# Altium schematic sheet DUT.SchDoc
size A1; SPICEModelCacheEPBFKGZM: <root> / <DocumentId>EPBFKGZM</DocumentId> / </root>
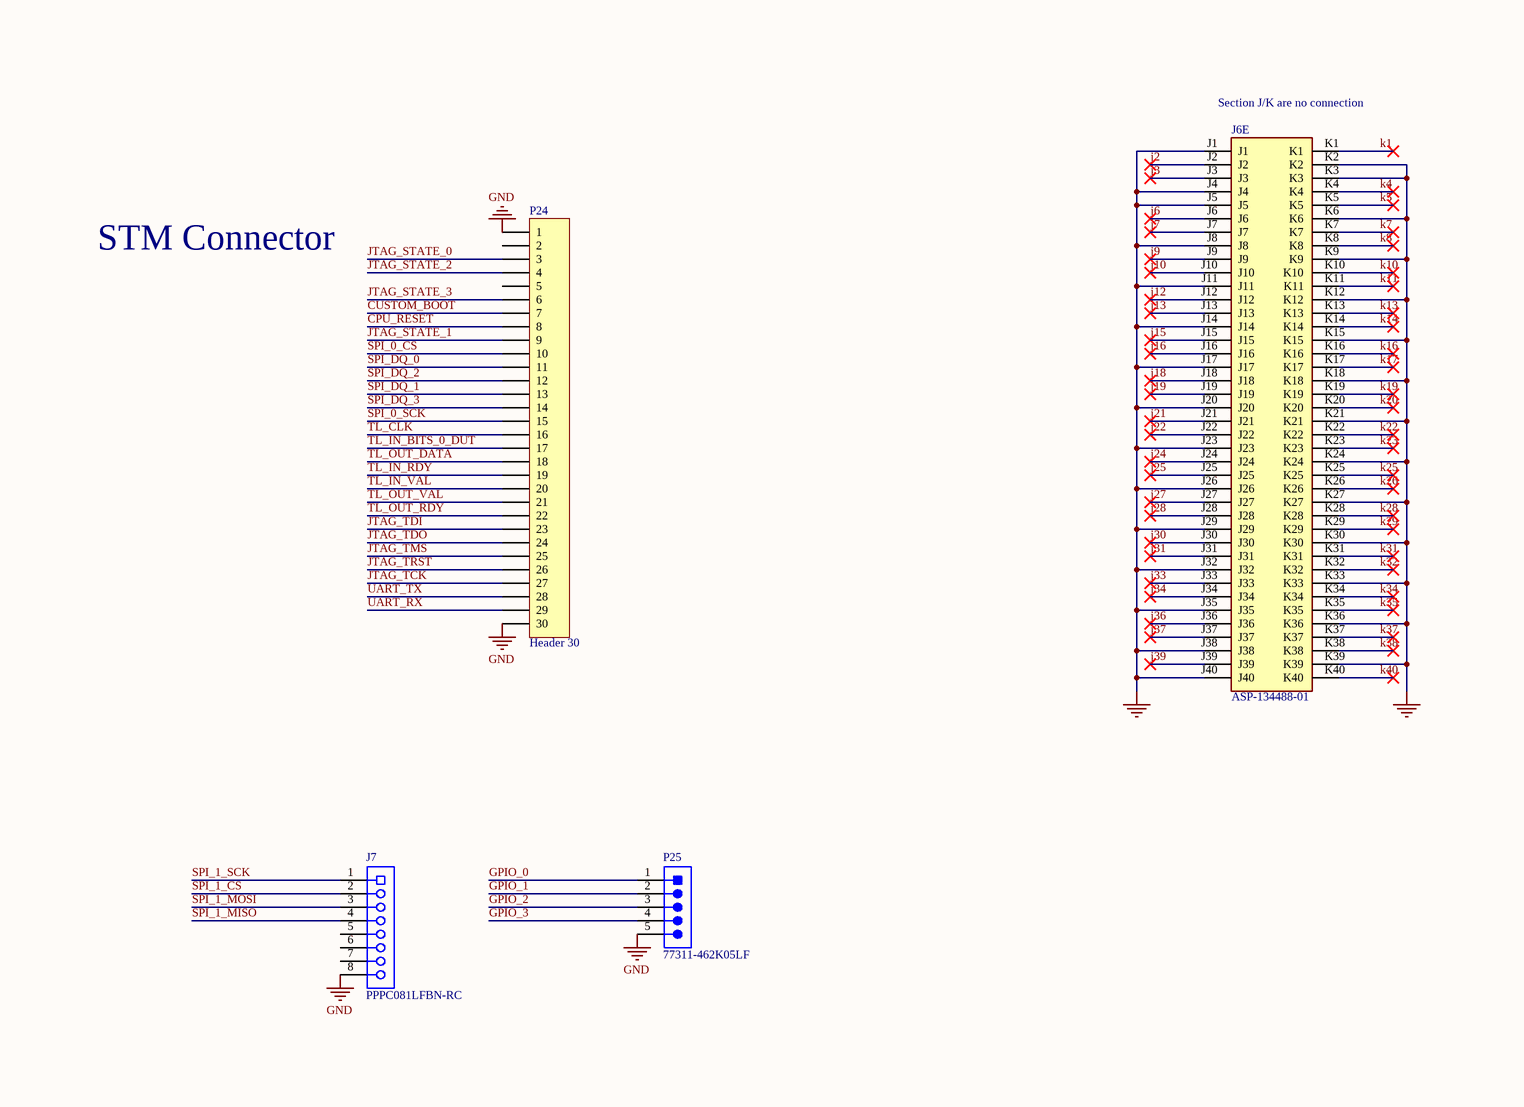
[diagram p0: DUT.SchDoc, centre left]
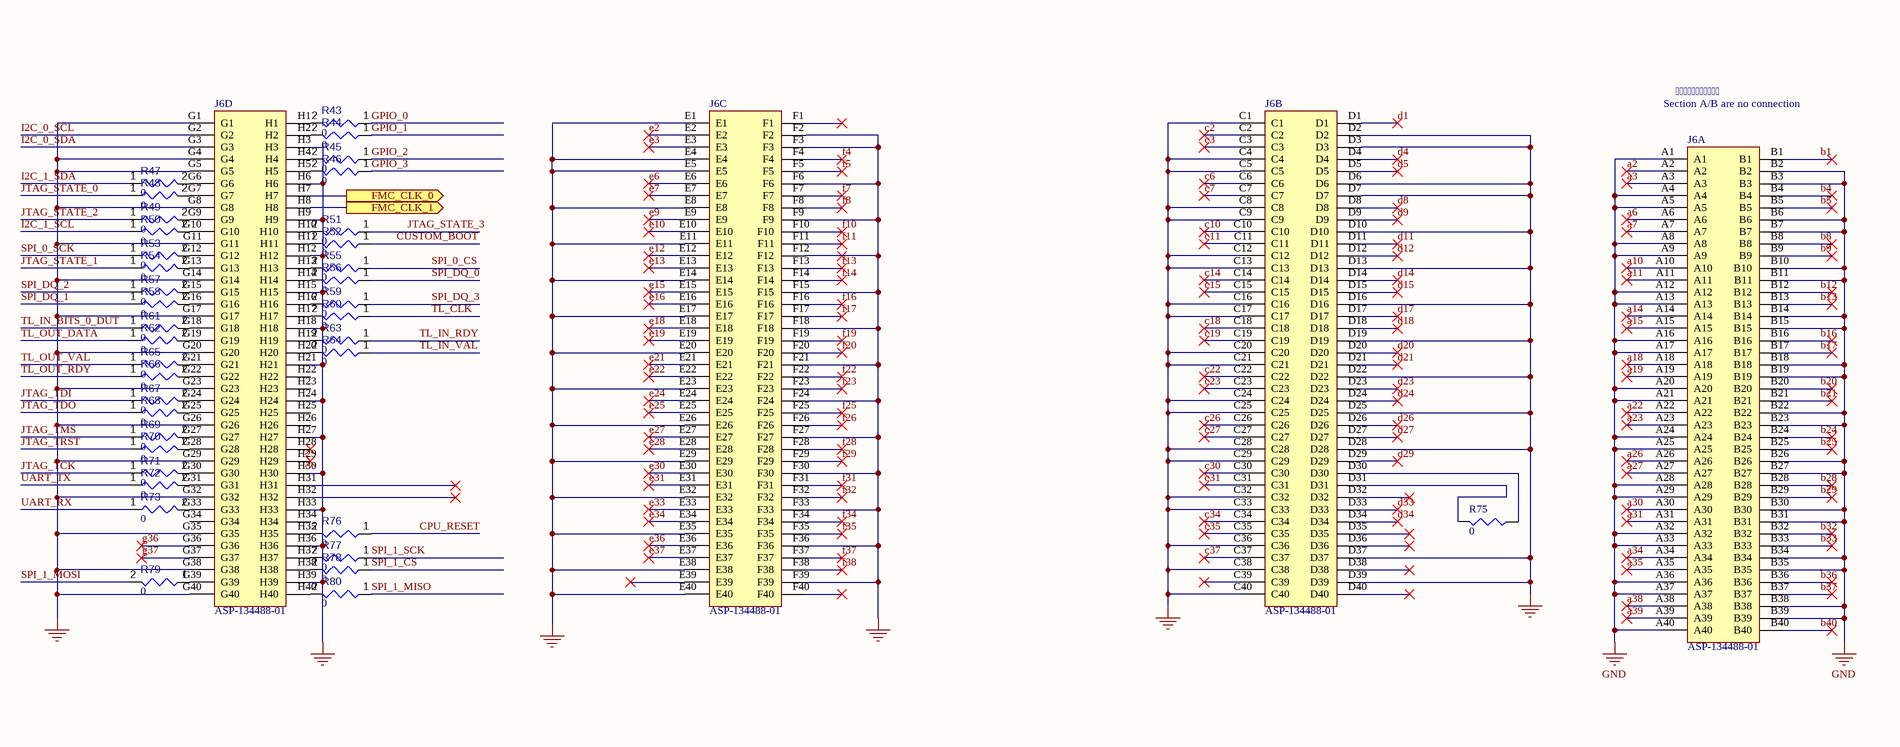
[diagram p1: DUT.SchDoc, centre right]
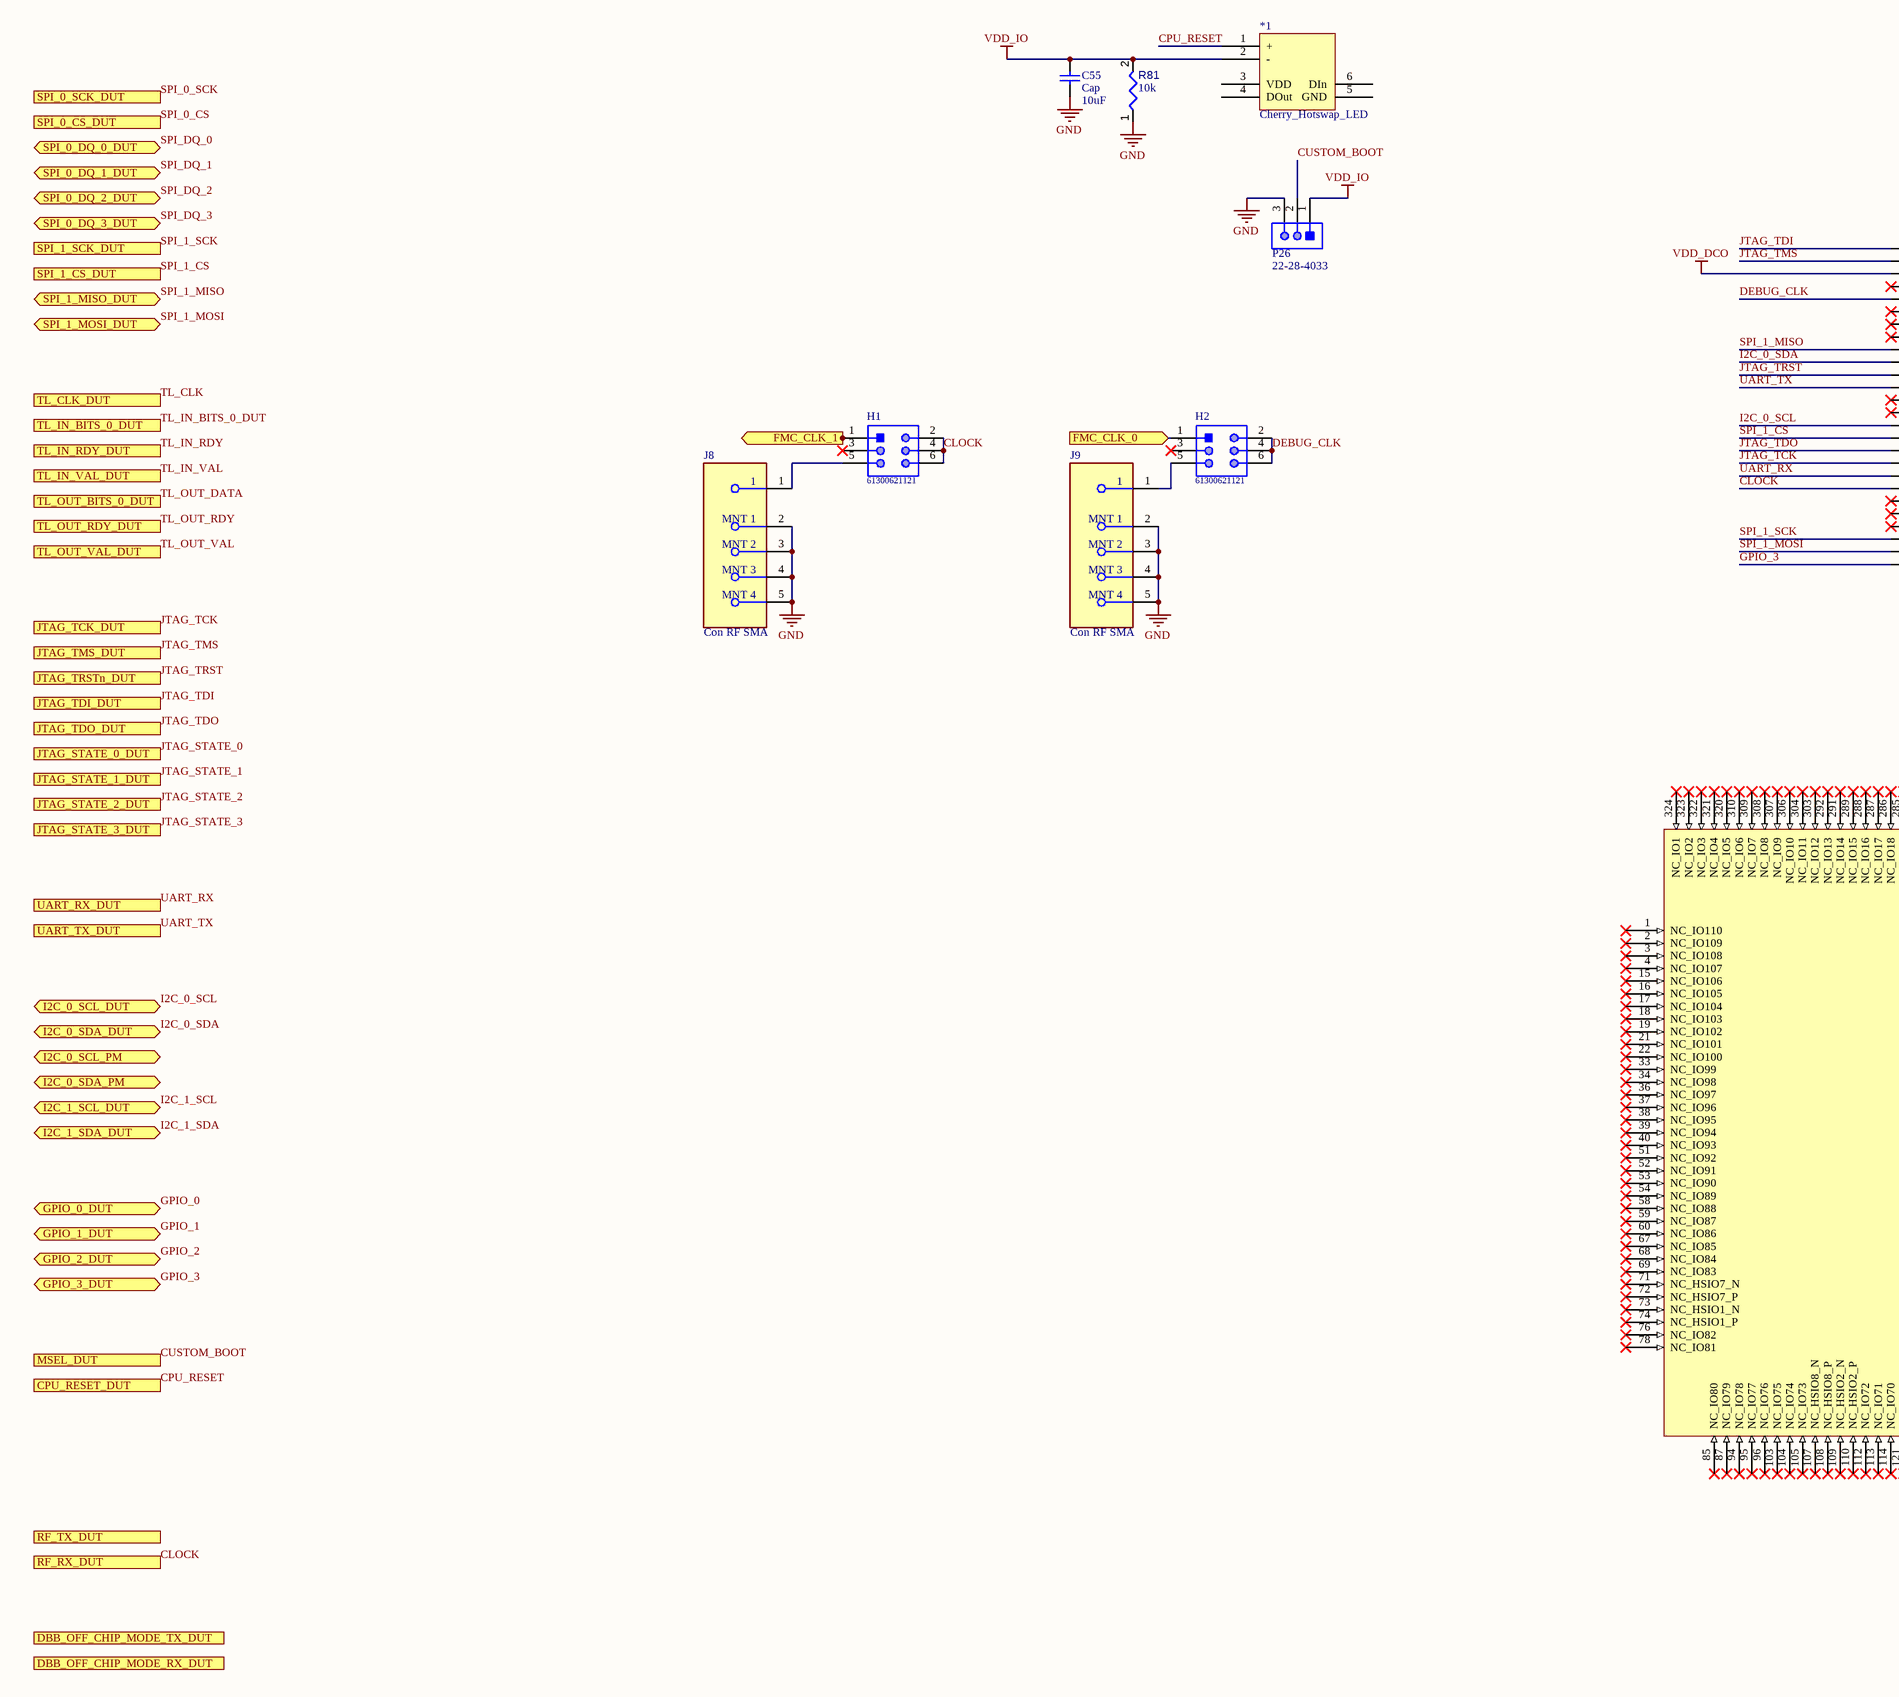
[diagram p2: DUT.SchDoc, bottom left]
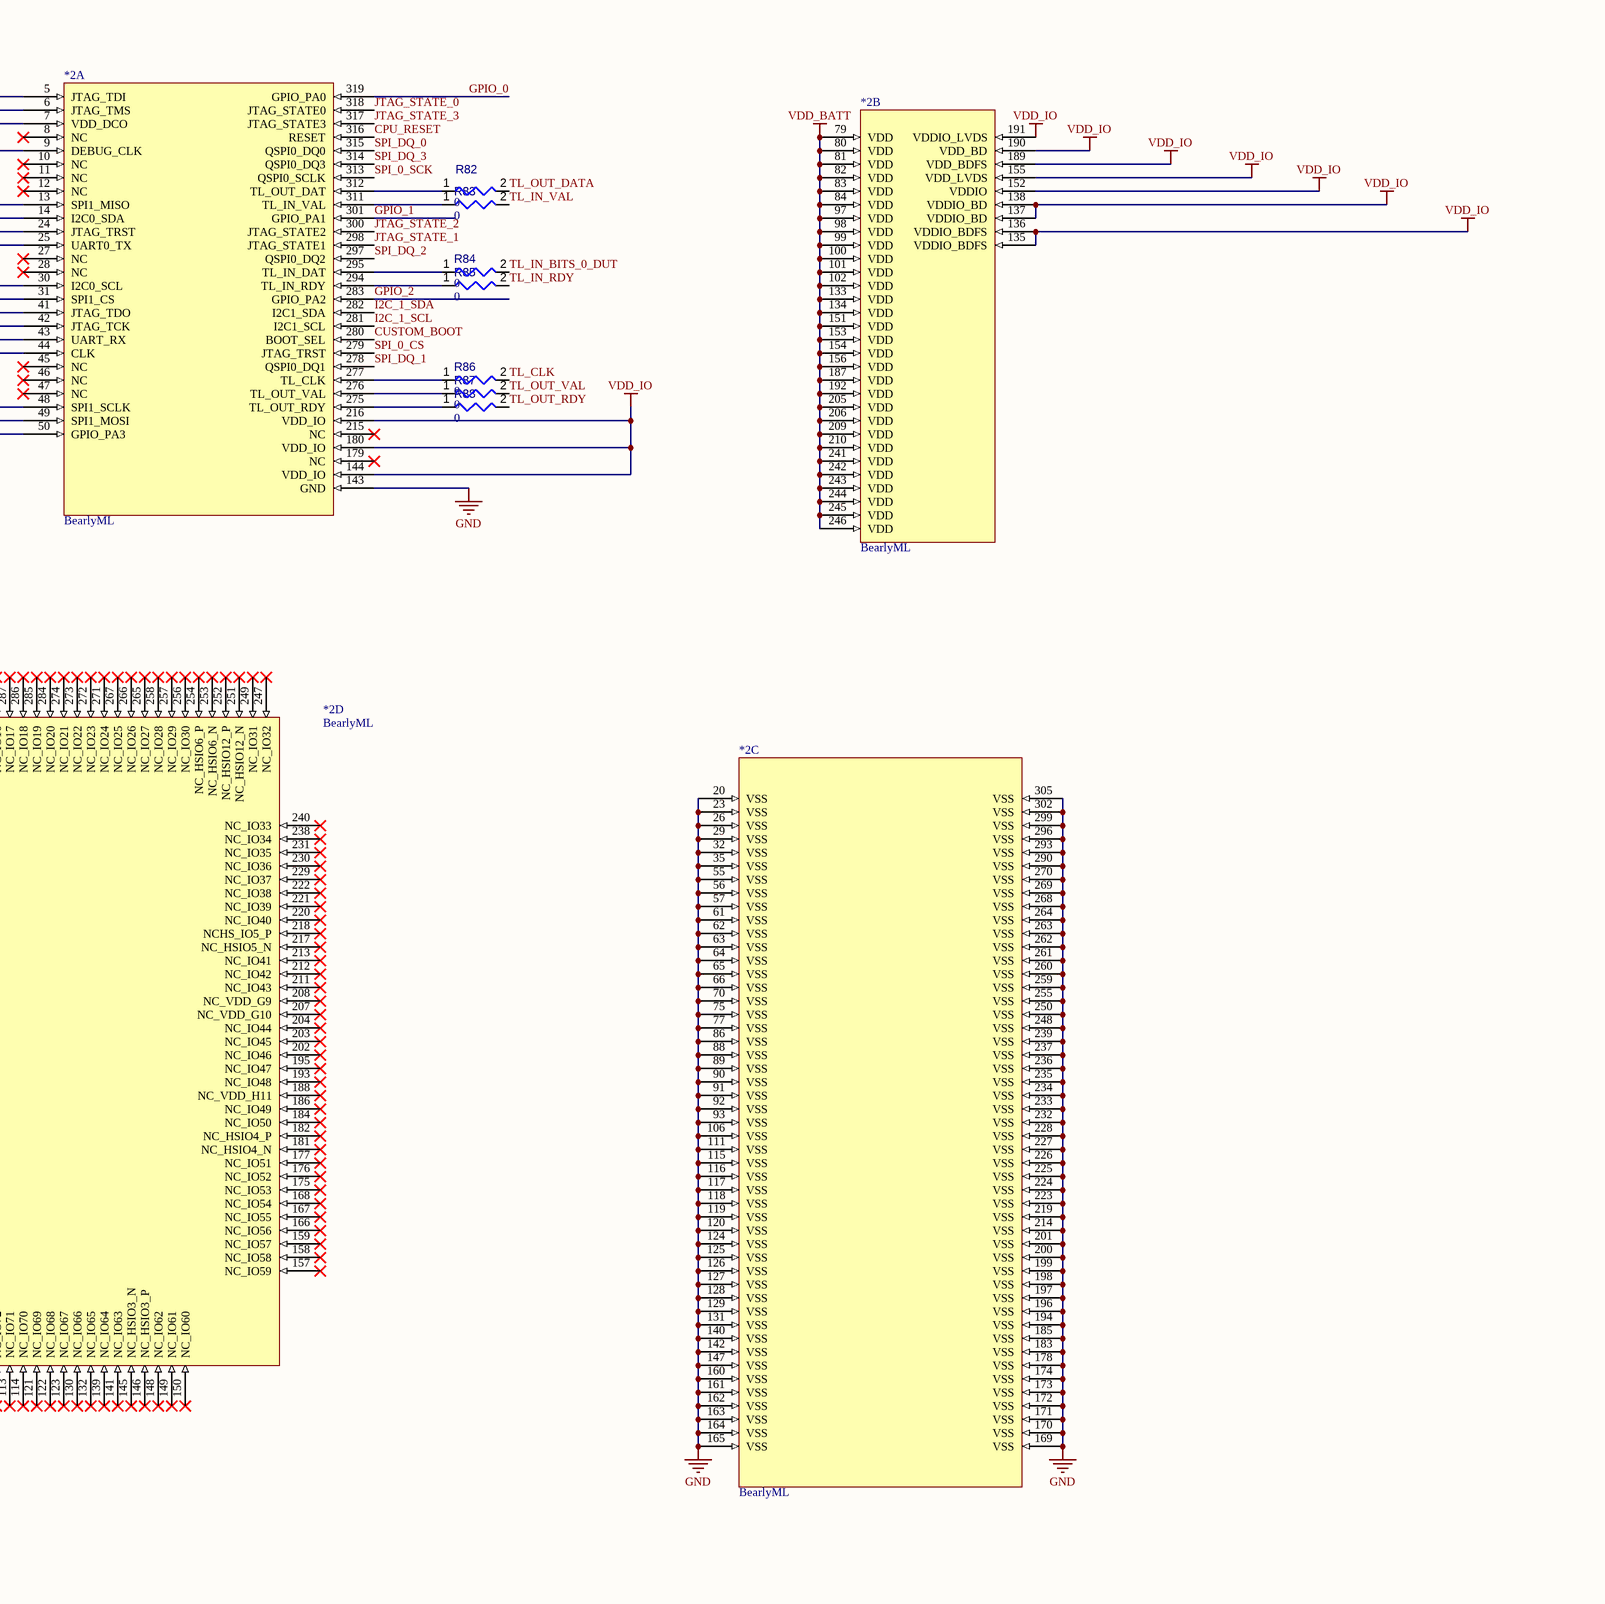
[diagram p3: DUT.SchDoc, bottom right]

## Parts
*1  Cherry_Hotswap_LED  [New footprint 1]
*2  BearlyML  [BGA324x18]  (parts A,B,C,D of 4)
C55  Cap  value 10uF  [0805]
H1  61300621121  [61300621121]
H2  61300621121  [61300621121]
J6  ASP-134488-01  [SAMTEC_ASP-134488-01]  (parts A,B,C,D,E of 5)
J7  PPPC081LFBN-RC  [SLIN-PPPC081LFBN-RC_V]
J8  Con RF SMA  [FP-RF2-04A-T-00-50-G-MFG]
J9  Con RF SMA  [FP-RF2-04A-T-00-50-G-MFG]
P24  Header 30  [HDR1X30]
P25  77311-462K05LF  [FCI-77311-5_V]
P26  22-28-4033  [MOLX-22-28-4033_V]
R43  value 0  [RESC0402(1005)_L]  (hidden comment: 0R2J)
R44  value 0  [RESC0402(1005)_L]  (hidden comment: 0R2J)
R45  value 0  [RESC0402(1005)_L]  (hidden comment: 0R2J)
R46  value 0  [RESC0402(1005)_L]  (hidden comment: 0R2J)
R47  value 0  [RESC0402(1005)_L]  (hidden comment: 0R2J)
R48  value 0  [RESC0402(1005)_L]  (hidden comment: 0R2J)
R49  value 0  [RESC0402(1005)_L]  (hidden comment: 0R2J)
R50  value 0  [RESC0402(1005)_L]  (hidden comment: 0R2J)
R51  value 0  [RESC0402(1005)_L]  (hidden comment: 0R2J)
R52  value 0  [RESC0402(1005)_L]  (hidden comment: 0R2J)
R53  value 0  [RESC0402(1005)_L]  (hidden comment: 0R2J)
R54  value 0  [RESC0402(1005)_L]  (hidden comment: 0R2J)
R55  value 0  [RESC0402(1005)_L]  (hidden comment: 0R2J)
R56  value 0  [RESC0402(1005)_L]  (hidden comment: 0R2J)
R57  value 0  [RESC0402(1005)_L]  (hidden comment: 0R2J)
R58  value 0  [RESC0402(1005)_L]  (hidden comment: 0R2J)
R59  value 0  [RESC0402(1005)_L]  (hidden comment: 0R2J)
R60  value 0  [RESC0402(1005)_L]  (hidden comment: 0R2J)
R61  value 0  [RESC0402(1005)_L]  (hidden comment: 0R2J)
R62  value 0  [RESC0402(1005)_L]  (hidden comment: 0R2J)
R63  value 0  [RESC0402(1005)_L]  (hidden comment: 0R2J)
R64  value 0  [RESC0402(1005)_L]  (hidden comment: 0R2J)
R65  value 0  [RESC0402(1005)_L]  (hidden comment: 0R2J)
R66  value 0  [RESC0402(1005)_L]  (hidden comment: 0R2J)
R67  value 0  [RESC0402(1005)_L]  (hidden comment: 0R2J)
R68  value 0  [RESC0402(1005)_L]  (hidden comment: 0R2J)
R69  value 0  [RESC0402(1005)_L]  (hidden comment: 0R2J)
R70  value 0  [RESC0402(1005)_L]  (hidden comment: 0R2J)
R71  value 0  [RESC0402(1005)_L]  (hidden comment: 0R2J)
R72  value 0  [RESC0402(1005)_L]  (hidden comment: 0R2J)
R73  value 0  [RESC0402(1005)_L]  (hidden comment: 0R2J)
R75  0  [0603]
R76  value 0  [RESC0402(1005)_L]  (hidden comment: 0R2J)
R77  value 0  [RESC0402(1005)_L]  (hidden comment: 0R2J)
R78  value 0  [RESC0402(1005)_L]  (hidden comment: 0R2J)
R79  value 0  [RESC0402(1005)_L]  (hidden comment: 0R2J)
R80  value 0  [RESC0402(1005)_L]  (hidden comment: 0R2J)
R81  value 10k  [RESC1608X55X25ML10T15]  (hidden comment: Resistor 10k +/-1% 0603 100 mW)
R82  value 0  [RESC0402(1005)_L]  (hidden comment: 0R2J)
R83  value 0  [RESC0402(1005)_L]  (hidden comment: 0R2J)
R84  value 0  [RESC0402(1005)_L]  (hidden comment: 0R2J)
R85  value 0  [RESC0402(1005)_L]  (hidden comment: 0R2J)
R86  value 0  [RESC0402(1005)_L]  (hidden comment: 0R2J)
R87  value 0  [RESC0402(1005)_L]  (hidden comment: 0R2J)
R88  value 0  [RESC0402(1005)_L]  (hidden comment: 0R2J)

## Ports
CPU_RESET_DUT (in), DBB_OFF_CHIP_MODE_RX_DUT (out), DBB_OFF_CHIP_MODE_TX_DUT (out), FMC_CLK_0 (in), FMC_CLK_0 (out), FMC_CLK_1 (out), GPIO_0_DUT (bidir), GPIO_1_DUT (bidir), GPIO_2_DUT (bidir), GPIO_3_DUT (bidir), I2C_0_SCL_DUT (bidir), I2C_0_SCL_PM (bidir), I2C_0_SDA_DUT (bidir), I2C_0_SDA_PM (bidir), I2C_1_SCL_DUT (bidir), I2C_1_SDA_DUT (bidir), JTAG_STATE_0_DUT (out), JTAG_STATE_1_DUT (out), JTAG_STATE_2_DUT (out), JTAG_STATE_3_DUT (out), JTAG_TCK_DUT (in), JTAG_TDI_DUT (in), JTAG_TDO_DUT (out), JTAG_TMS_DUT (in), JTAG_TRSTn_DUT (in), MSEL_DUT (out), RF_RX_DUT (in), RF_TX_DUT (out), SPI_0_CS_DUT (out), SPI_0_DQ_0_DUT (bidir), SPI_0_DQ_1_DUT (bidir), SPI_0_DQ_2_DUT (bidir), SPI_0_DQ_3_DUT (bidir), SPI_0_SCK_DUT (out), SPI_1_CS_DUT (out), SPI_1_MISO_DUT (bidir), SPI_1_MOSI_DUT (bidir), SPI_1_SCK_DUT (out), TL_CLK_DUT (out), TL_IN_BITS_0_DUT (in), TL_IN_RDY_DUT (out), TL_IN_VAL_DUT (in), TL_OUT_BITS_0_DUT (out), TL_OUT_RDY_DUT (in), TL_OUT_VAL_DUT (out), UART_RX_DUT (in), UART_TX_DUT (out)

## Nets
GND: *2.20(VSS) *2.23(VSS) *2.26(VSS) *2.29(VSS) *2.32(VSS) *2.35(VSS) *2.55(VSS) *2.56(VSS) *2.57(VSS) *2.61(VSS) *2.62(VSS) *2.63(VSS) *2.64(VSS) *2.65(VSS) *2.66(VSS) *2.70(VSS) *2.75(VSS) *2.77(VSS) *2.86(VSS) *2.88(VSS) *2.89(VSS) *2.90(VSS) *2.91(VSS) *2.92(VSS) *2.93(VSS) *2.106(VSS) *2.111(VSS) *2.115(VSS) *2.116(VSS) *2.117(VSS) *2.118(VSS) *2.119(VSS) *2.120(VSS) *2.124(VSS) *2.125(VSS) *2.126(VSS) *2.127(VSS) *2.128(VSS) *2.129(VSS) *2.131(VSS) *2.140(VSS) *2.142(VSS) *2.143(GND) *2.147(VSS) *2.160(VSS) *2.161(VSS) *2.162(VSS) *2.163(VSS) *2.164(VSS) *2.165(VSS) *2.169(VSS) *2.170(VSS) *2.171(VSS) *2.172(VSS) *2.173(VSS) *2.174(VSS) *2.178(VSS) *2.183(VSS) *2.185(VSS) *2.194(VSS) *2.196(VSS) *2.197(VSS) *2.198(VSS) *2.199(VSS) *2.200(VSS) *2.201(VSS) *2.214(VSS) *2.219(VSS) *2.223(VSS) *2.224(VSS) *2.225(VSS) *2.226(VSS) *2.227(VSS) *2.228(VSS) *2.232(VSS) *2.233(VSS) *2.234(VSS) *2.235(VSS) *2.236(VSS) *2.237(VSS) *2.239(VSS) *2.248(VSS) *2.250(VSS) *2.255(VSS) *2.259(VSS) *2.260(VSS) *2.261(VSS) *2.262(VSS) *2.263(VSS) *2.264(VSS) *2.268(VSS) *2.269(VSS) *2.270(VSS) *2.290(VSS) *2.293(VSS) *2.296(VSS) *2.299(VSS) *2.302(VSS) *2.305(VSS) C55.1 J6.A1 J6.A4 J6.A5 J6.A8 J6.A9 J6.A12 J6.A13 J6.A16 J6.A17 J6.A20 J6.A21 J6.A24 J6.A25 J6.A28 J6.A29 J6.A32 J6.A33 J6.A36 J6.A37 J6.A40 J6.B2 J6.B3 J6.B6 J6.B7 J6.B10 J6.B11 J6.B14 J6.B15 J6.B18 J6.B19 J6.B22 J6.B23 J6.B26 J6.B27 J6.B30 J6.B31 J6.B34 J6.B35 J6.B38 J6.B39 J6.C1 J6.C4 J6.C5 J6.C8 J6.C9 J6.C12 J6.C13 J6.C16 J6.C17 J6.C20 J6.C21 J6.C24 J6.C25 J6.C28 J6.C29 J6.C32 J6.C33 J6.C36 J6.C38 J6.C40 J6.D2 J6.D3 J6.D6 J6.D7 J6.D10 J6.D13 J6.D16 J6.D19 J6.D22 J6.D25 J6.D28 J6.D37 J6.D39 J6.E1 J6.E4 J6.E5 J6.E8 J6.E11 J6.E14 J6.E17 J6.E20 J6.E23 J6.E26 J6.E29 J6.E32 J6.E35 J6.E38 J6.E40 J6.F2 J6.F3 J6.F6 J6.F9 J6.F12 J6.F15 J6.F18 J6.F21 J6.F24 J6.F27 J6.F30 J6.F33 J6.F36 J6.F39 J6.G1 J6.G4 J6.G5 J6.G8 J6.G11 J6.G14 J6.G17 J6.G20 J6.G23 J6.G26 J6.G29 J6.G32 J6.G35 J6.G38 J6.G40 J6.H3 J6.H6 J6.H9 J6.H12 J6.H15 J6.H18 J6.H21 J6.H24 J6.H27 J6.H30 J6.H33 J6.H36 J6.H39 J6.J1 J6.J4 J6.J5 J6.J8 J6.J11 J6.J14 J6.J17 J6.J20 J6.J23 J6.J26 J6.J29 J6.J32 J6.J35 J6.J38 J6.J40 J6.K2 J6.K3 J6.K6 J6.K9 J6.K12 J6.K15 J6.K18 J6.K21 J6.K24 J6.K27 J6.K30 J6.K33 J6.K36 J6.K39 J7.8 J8.2(MNT_1) J8.3(MNT_2) J8.4(MNT_3) J8.5(MNT_4) J9.2(MNT_1) J9.3(MNT_2) J9.4(MNT_3) J9.5(MNT_4) P24.1 P24.30 P25.5(CTS) P26.3 R81.1
VDD_BATT: *2.79(VDD) *2.80(VDD) *2.81(VDD) *2.82(VDD) *2.83(VDD) *2.84(VDD) *2.97(VDD) *2.98(VDD) *2.99(VDD) *2.100(VDD) *2.101(VDD) *2.102(VDD) *2.133(VDD) *2.134(VDD) *2.151(VDD) *2.153(VDD) *2.154(VDD) *2.156(VDD) *2.187(VDD) *2.192(VDD) *2.205(VDD) *2.206(VDD) *2.209(VDD) *2.210(VDD) *2.241(VDD) *2.242(VDD) *2.243(VDD) *2.244(VDD) *2.245(VDD) *2.246(VDD)
VDD_DCO: *2.7(VDD_DCO)
VDD_IO: *1.2(-) *2.135(VDDIO_BDFS) *2.136(VDDIO_BDFS) *2.137(VDDIO_BD) *2.138(VDDIO_BD) *2.144(VDD_IO) *2.152(VDDIO) *2.155(VDD_LVDS) *2.180(VDD_IO) *2.189(VDD_BDFS) *2.190(VDD_BD) *2.191(VDDIO_LVDS) *2.216(VDD_IO) C55.2 P26.1 R81.2
a2: J6.A2
a3: J6.A3
a6: J6.A6
a7: J6.A7
a10: J6.A10
a11: J6.A11
a14: J6.A14
a15: J6.A15
a18: J6.A18
a19: J6.A19
a22: J6.A22
a23: J6.A23
a26: J6.A26
a27: J6.A27
a30: J6.A30
a31: J6.A31
a34: J6.A34
a35: J6.A35
a38: J6.A38
a39: J6.A39
b1: J6.B1
b4: J6.B4
b5: J6.B5
b8: J6.B8
b9: J6.B9
b12: J6.B12
b13: J6.B13
b16: J6.B16
b17: J6.B17
b20: J6.B20
b21: J6.B21
b24: J6.B24
b25: J6.B25
b28: J6.B28
b29: J6.B29
b32: J6.B32
b33: J6.B33
b36: J6.B36
b37: J6.B37
b40: J6.B40
c2: J6.C2
c3: J6.C3
c6: J6.C6
c7: J6.C7
c10: J6.C10
c11: J6.C11
c14: J6.C14
c15: J6.C15
c18: J6.C18
c19: J6.C19
c22: J6.C22
c23: J6.C23
c26: J6.C26
c27: J6.C27
c30: J6.C30
c31: J6.C31
c34: J6.C34
c35: J6.C35
c37: J6.C37
CLOCK: *2.44(CLK) H1.2 H1.4 H1.6 ; port RF_RX_DUT
CPU_RESET: *1.1(+) *2.316(RESET) P24.8 R76.1 ; port CPU_RESET_DUT
CUSTOM_BOOT: *2.280(BOOT_SEL) P24.7 P26.2 R52.1 ; port MSEL_DUT
d1: J6.D1
d4: J6.D4
d5: J6.D5
d8: J6.D8
d9: J6.D9
d11: J6.D11
d12: J6.D12
d14: J6.D14
d15: J6.D15
d17: J6.D17
d18: J6.D18
d20: J6.D20
d21: J6.D21
d23: J6.D23
d24: J6.D24
d26: J6.D26
d27: J6.D27
d29: J6.D29
d33: J6.D33
d34: J6.D34
DEBUG_CLK: *2.9(DEBUG_CLK) H2.2 H2.4 H2.6
e2: J6.E2
e3: J6.E3
e6: J6.E6
e7: J6.E7
e9: J6.E9
e10: J6.E10
e12: J6.E12
e13: J6.E13
e15: J6.E15
e16: J6.E16
e18: J6.E18
e19: J6.E19
e21: J6.E21
e22: J6.E22
e24: J6.E24
e25: J6.E25
e27: J6.E27
e28: J6.E28
e30: J6.E30
e31: J6.E31
e33: J6.E33
e34: J6.E34
e36: J6.E36
e37: J6.E37
f4: J6.F4
f5: J6.F5
f7: J6.F7
f8: J6.F8
f10: J6.F10
f11: J6.F11
f13: J6.F13
f14: J6.F14
f16: J6.F16
f17: J6.F17
f19: J6.F19
f20: J6.F20
f22: J6.F22
f23: J6.F23
f25: J6.F25
f26: J6.F26
f28: J6.F28
f29: J6.F29
f31: J6.F31
f32: J6.F32
f34: J6.F34
f35: J6.F35
f37: J6.F37
f38: J6.F38
FMC_CLK_0: H2.1 J6.H7 ; port FMC_CLK_0
FMC_CLK_1: H1.1 J6.H8 ; port FMC_CLK_1
g36: J6.G36
g37: J6.G37
GPIO_0: *2.319(GPIO_PA0) P25.1(DTR) R43.1 ; port GPIO_0_DUT
GPIO_1: *2.301(GPIO_PA1) P25.2(RXI) R44.1 ; port GPIO_1_DUT
GPIO_2: *2.283(GPIO_PA2) P25.3(TXO) R45.1 ; port GPIO_2_DUT
GPIO_3: *2.50(GPIO_PA3) P25.4(VCC) R46.1 ; port GPIO_3_DUT
I2C_0_SCL: *2.30(I2C0_SCL) J6.G2 ; port I2C_0_SCL_DUT
I2C_0_SDA: *2.14(I2C0_SDA) J6.G3 ; port I2C_0_SDA_DUT
I2C_1_SCL: *2.281(I2C1_SCL) R50.1 ; port I2C_1_SCL_DUT
I2C_1_SDA: *2.282(I2C1_SDA) R47.1 ; port I2C_1_SDA_DUT
j2: J6.J2
j3: J6.J3
j6: J6.J6
j7: J6.J7
j9: J6.J9
j10: J6.J10
j12: J6.J12
j13: J6.J13
j15: J6.J15
j16: J6.J16
j18: J6.J18
j19: J6.J19
j21: J6.J21
j22: J6.J22
j24: J6.J24
j25: J6.J25
j27: J6.J27
j28: J6.J28
j30: J6.J30
j31: J6.J31
j33: J6.J33
j34: J6.J34
j36: J6.J36
j37: J6.J37
j39: J6.J39
JTAG_STATE_0: *2.318(JTAG_STATE0) P24.3 R48.1 ; port JTAG_STATE_0_DUT
JTAG_STATE_1: *2.298(JTAG_STATE1) P24.9 R54.1 ; port JTAG_STATE_1_DUT
JTAG_STATE_2: *2.300(JTAG_STATE2) P24.4 R49.1 ; port JTAG_STATE_2_DUT
JTAG_STATE_3: *2.317(JTAG_STATE3) P24.6 R51.1 ; port JTAG_STATE_3_DUT
JTAG_TCK: *2.42(JTAG_TCK) P24.27 R71.1 ; port JTAG_TCK_DUT
JTAG_TDI: *2.5(JTAG_TDI) P24.23 R67.1 ; port JTAG_TDI_DUT
JTAG_TDO: *2.41(JTAG_TDO) P24.24 R68.1 ; port JTAG_TDO_DUT
JTAG_TMS: *2.6(JTAG_TMS) P24.25 R69.1 ; port JTAG_TMS_DUT
JTAG_TRST: *2.24(JTAG_TRST) P24.26 R70.1 ; port JTAG_TRSTn_DUT
k1: J6.K1
k4: J6.K4
k5: J6.K5
k7: J6.K7
k8: J6.K8
k10: J6.K10
k11: J6.K11
k13: J6.K13
k14: J6.K14
k16: J6.K16
k17: J6.K17
k19: J6.K19
k20: J6.K20
k22: J6.K22
k23: J6.K23
k25: J6.K25
k26: J6.K26
k28: J6.K28
k29: J6.K29
k31: J6.K31
k32: J6.K32
k34: J6.K34
k35: J6.K35
k37: J6.K37
k38: J6.K38
k40: J6.K40
SPI_0_CS: *2.279(JTAG_TRST) P24.10 R55.1 ; port SPI_0_CS_DUT
SPI_0_SCK: *2.313(QSPI0_SCLK) P24.15 R53.1 ; port SPI_0_SCK_DUT
SPI_1_CS: *2.31(SPI1_CS) J7.2 R78.1 ; port SPI_1_CS_DUT
SPI_1_MISO: *2.13(SPI1_MISO) J7.4 R80.1 ; port SPI_1_MISO_DUT
SPI_1_MOSI: *2.49(SPI1_MOSI) J7.3 R79.2 ; port SPI_1_MOSI_DUT
SPI_1_SCK: *2.48(SPI1_SCLK) J7.1 R77.1 ; port SPI_1_SCK_DUT
SPI_DQ_0: *2.315(QSPI0_DQ0) P24.11 R56.1 ; port SPI_0_DQ_0_DUT
SPI_DQ_1: *2.278(QSPI0_DQ1) P24.13 R58.1 ; port SPI_0_DQ_1_DUT
SPI_DQ_2: *2.297(QSPI0_DQ2) P24.12 R57.1 ; port SPI_0_DQ_2_DUT
SPI_DQ_3: *2.314(QSPI0_DQ3) P24.14 R59.1 ; port SPI_0_DQ_3_DUT
TL_CLK: P24.16 R60.1 R86.2 ; port TL_CLK_DUT
TL_IN_BITS_0_DUT: P24.17 R61.1 R84.2 ; port TL_IN_BITS_0_DUT
TL_IN_RDY: P24.19 R63.1 R85.2 ; port TL_IN_RDY_DUT
TL_IN_VAL: P24.20 R64.1 R83.2 ; port TL_IN_VAL_DUT
TL_OUT_DATA: P24.18 R62.1 R82.2 ; port TL_OUT_BITS_0_DUT
TL_OUT_RDY: P24.22 R66.1 R88.2 ; port TL_OUT_RDY_DUT
TL_OUT_VAL: P24.21 R65.1 R87.2 ; port TL_OUT_VAL_DUT
UART_RX: *2.43(UART_RX) P24.29 R73.1 ; port UART_RX_DUT
UART_TX: *2.25(UART0_TX) P24.28 R72.1 ; port UART_TX_DUT
Net*2_275: *2.275(TL_OUT_RDY) R88.1
Net*2_276: *2.276(TL_OUT_VAL) R87.1
Net*2_277: *2.277(TL_CLK) R86.1
Net*2_294: *2.294(TL_IN_RDY) R85.1
Net*2_295: *2.295(TL_IN_DAT) R84.1
Net*2_311: *2.311(TL_IN_VAL) R83.1
Net*2_312: *2.312(TL_OUT_DAT) R82.1
NetH1_5: H1.5 J8.1
NetH2_5: H2.5 J9.1
NetJ6_D30: J6.D30 R75.2
NetJ6_D31: J6.D31 R75.1
NetJ6_G6: J6.G6 R47.2
NetJ6_G7: J6.G7 R48.2
NetJ6_G9: J6.G9 R49.2
NetJ6_G10: J6.G10 R50.2
NetJ6_G12: J6.G12 R53.2
NetJ6_G13: J6.G13 R54.2
NetJ6_G15: J6.G15 R57.2
NetJ6_G16: J6.G16 R58.2
NetJ6_G18: J6.G18 R61.2
NetJ6_G19: J6.G19 R62.2
NetJ6_G21: J6.G21 R65.2
NetJ6_G22: J6.G22 R66.2
NetJ6_G24: J6.G24 R67.2
NetJ6_G25: J6.G25 R68.2
NetJ6_G27: J6.G27 R69.2
NetJ6_G28: J6.G28 R70.2
NetJ6_G30: J6.G30 R71.2
NetJ6_G31: J6.G31 R72.2
NetJ6_G33: J6.G33 R73.2
NetJ6_G39: J6.G39 R79.1
NetJ6_H1: J6.H1 R43.2
NetJ6_H2: J6.H2 R44.2
NetJ6_H4: J6.H4 R45.2
NetJ6_H5: J6.H5 R46.2
NetJ6_H10: J6.H10 R51.2
NetJ6_H11: J6.H11 R52.2
NetJ6_H13: J6.H13 R55.2
NetJ6_H14: J6.H14 R56.2
NetJ6_H16: J6.H16 R59.2
NetJ6_H17: J6.H17 R60.2
NetJ6_H19: J6.H19 R63.2
NetJ6_H20: J6.H20 R64.2
NetJ6_H35: J6.H35 R76.2
NetJ6_H37: J6.H37 R77.2
NetJ6_H38: J6.H38 R78.2
NetJ6_H40: J6.H40 R80.2

Not connected (* = marked no-connect by the designer): *1 3(VDD) 4(DOut) 5(GND) 6(DIn); *2 1(NC_IO110)* 2(NC_IO109)* 3(NC_IO108)* 4(NC_IO107)* 8(NC)* 10(NC)* 11(NC)* 12(NC)* 15(NC_IO106)* 16(NC_IO105)* 17(NC_IO104)* 18(NC_IO103)* 19(NC_IO102)* 21(NC_IO101)* 22(NC_IO100)* 27(NC)* 28(NC)* 33(NC_IO99)* 34(NC_IO98)* 36(NC_IO97)* 37(NC_IO96)* 38(NC_IO95)* 39(NC_IO94)* 40(NC_IO93)* 45(NC)* 46(NC)* 47(NC)* 51(NC_IO92)* 52(NC_IO91)* 53(NC_IO90)* 54(NC_IO89)* 58(NC_IO88)* 59(NC_IO87)* 60(NC_IO86)* 67(NC_IO85)* 68(NC_IO84)* 69(NC_IO83)* 71(NC_HSIO7_N)* 72(NC_HSIO7_P)* 73(NC_HSIO1_N)* 74(NC_HSIO1_P)* 76(NC_IO82)* 78(NC_IO81)* 85(NC_IO80)* 87(NC_IO79)* 94(NC_IO78)* 95(NC_IO77)* 96(NC_IO76)* 103(NC_IO75)* 104(NC_IO74)* 105(NC_IO73)* 107(NC_HSIO8_N)* 108(NC_HSIO8_P)* 109(NC_HSIO2_N)* 110(NC_HSIO2_P)* 112(NC_IO72)* 113(NC_IO71)* 114(NC_IO70)* 121(NC_IO69)* 122(NC_IO68)* 123(NC_IO67)* 130(NC_IO66)* 132(NC_IO65)* 139(NC_IO64)* 141(NC_IO63)* 145(NC_HSIO3_N)* 146(NC_HSIO3_P)* 148(NC_IO62)* 149(NC_IO61)* 150(NC_IO60)* 157(NC_IO59)* 158(NC_IO58)* 159(NC_IO57)* 166(NC_IO56)* 167(NC_IO55)* 168(NC_IO54)* 175(NC_IO53)* 176(NC_IO52)* 177(NC_IO51)* 179(NC)* 181(NC_HSIO4_N)* 182(NC_HSIO4_P)* 184(NC_IO50)* 186(NC_IO49)* 188(NC_VDD_H11)* 193(NC_IO48)* 195(NC_IO47)* 202(NC_IO46)* 203(NC_IO45)* 204(NC_IO44)* 207(NC_VDD_G10)* 208(NC_VDD_G9)* 211(NC_IO43)* 212(NC_IO42)* 213(NC_IO41)* 215(NC)* 217(NC_HSIO5_N)* 218(NCHS_IO5_P)* 220(NC_IO40)* 221(NC_IO39)* 222(NC_IO38)* 229(NC_IO37)* 230(NC_IO36)* 231(NC_IO35)* 238(NC_IO34)* 240(NC_IO33)* 247(NC_IO32)* 249(NC_IO31)* 251(NC_HSIO12_N)* 252(NC_HSIO12_P)* 253(NC_HSIO6_N)* 254(NC_HSIO6_P)* 256(NC_IO30)* 257(NC_IO29)* 258(NC_IO28)* 265(NC_IO27)* 266(NC_IO26)* 267(NC_IO25)* 271(NC_IO24)* 272(NC_IO23)* 273(NC_IO22)* 274(NC_IO21)* 284(NC_IO20)* 285(NC_IO19)* 286(NC_IO18)* 287(NC_IO17)* 288(NC_IO16)* 289(NC_IO15)* 291(NC_IO14)* 292(NC_IO13)* 303(NC_IO12)* 304(NC_IO11)* 306(NC_IO10)* 307(NC_IO9)* 308(NC_IO8)* 309(NC_IO7)* 310(NC_IO6)* 320(NC_IO5)* 321(NC_IO4)* 322(NC_IO3)* 323(NC_IO2)* 324(NC_IO1)*; H1 3*; H2 3*; J6 C39* D32* D35* D36* D38* D40* E39* F1* F40* G34 H22 H23 H25 H26 H28* H29* H31* H32* H34; J7 5 6 7; P24 2 5

## Notes on the sheet
- (near J6) Section J/K are no connection
- Section A/B are no connection
- 
- STM Connector

## Library data of the parts
*1 = CMP-00028-00007-1
*2 = BearlyML-2: BearlyML chip from Sp22 Tapeout class
C55 = Cap: Capacitor; Published: 8-Jun-2000; LatestRevisionDate: 17-Jul-2002; LatestRevisionNote: Re-released for DXP Platform.; PackageReference: RAD-0.3; Publisher: Altium Limited; PackageDescription: Radial Cap, Thru-Hole; 2 Leads; 0.3 in Pin Spacing
H1 H2 = CMP-1502-01072-1: THT Vertical Pin Header WR-PHD, Pitch 2.54 mm, Dual Row, 6 pins; Manufacturer: Wurth Elektronik; Contact Resistance: 20mOhm; Withstanding Voltage: 500VAC; Pin Number: 6; Gender: Male; Pitch: 2.54mm; Working Voltage: 250VAC; Rated Current: 3A; Packaging: Bag; Row Number: Dual; Manufacturer URL: http://www.we-online.de; Part Number: 61300621121; Operating Temperature: -40to105degC; Mounting Technology: THT; Package Reference: 61300621121; Datasheet URL: https://katalog.we-online.de/em/datasheet/6130xx21121.pdf; Orientation: Vertical; Publisher: WurthElektronik
J6 = CMP-013-000000-2: Board-To-Board Connector, Vita 57 XMC, ASP Series, Surface Mount, Header, 400, 1.27 mm; Source: ASP-134488-01.SchLib; MP: ASP-134488-01; Package: None; Component Type: Standard; Availability: Unavailable; Design Item ID: ASP-134488-01; Value: *; Price: None; Pin Count: 400
J7 = CMP-002-00028-2: Female Header, Pitch 2.54 mm, 1 x 8 Position, Height 8.5 mm, Tail Length 3.2 mm, -40 to 105 degC, RoHS, Bulk; Manufacturer: Sullins; Package Reference: PPPC081LFBN-RC; Connector Type: Header; Datasheet Version: Jan-15; Package Description: Female Header, Pitch 2.54 mm, 1 x 8 Position, Height 8.5 mm, Tail Length 3.2 mm; RoHS Compliant: Unknown; Max Operating Temperature: 105°C; Case/Package: PPPC081LFBN-RC; Min Operating Temperature: -40°C; Datasheet URL: http://sullinscorp.com/catalogs/101_PAGE114-115_.100_FEMALE_HDR.pdf; Gender: Female; Mounting Technology: TH
J8 J9 = CMP-42753-000002-1: CONN SMA JACK STR 50 OHM PCB
P24 = Header 30: Header, 30-Pin; LatestRevisionDate: 17-Jul-2002; LatestRevisionNote: Re-released for DXP Platform.; Publisher: Altium Limited
P25 = CMP-002-00021-2: Male Header, Pitch 2.54 mm, 1 x 5 Position, Height 16.24 mm, Tail Length 3.05 mm, -65 to 125 degC, RoHS, Tape and Reel; Manufacturer: FCI Electronics; Connector Type: Header; Manufacturer URL: http://portal.fciconnect.com/; Datasheet URL: http://portal.fciconnect.com/Comergent//fci/drawing/77311.pdf; Gender: Male; Case/Package: 77311-5; Package Reference: 77311-5; Datasheet Version: Rev. CK, 07/2016; Package Description: Male Header, Pitch 2.54 mm, 1 x 5 Position, Height 16.24 mm, Tail Length 3.05 mm; RoHS Compliant: Unknown; Mounting Technology: TH
P26 = CMP-1676-00001-5: Male Header, Pitch 2.54 mm, 1 x 3 Position, Height 8.38 mm, Tail Length 3.18 mm, RoHS, Bulk; Manufacturer: Molex; Rows: 1; Voltage Rating: 250 V; Current Rating: 4 A; Min Operating Temperature: 0 degC; Lead Pitch: 0.1 inch; Packaging: Bulk; Contact Finish: Gold; RoHSCompliant: true; Contact Material: Brass; PackageReference: 22-28-4033; REACH SVHC: Unknown; PackageDescription: Male Header, Pitch 2.54 mm, 1 x 3 Position, Height 8.38 mm, Tail Length 3.18 mm; ComponentLink2URL: http://www.molex.com/pdm_docs/sd/022284033_sd.pdf; Height: 8.38 mm; Mounting Technology: Through Hole; ComponentLink1Description: Manufacturer URL; Length: 7.62 mm; Mount: Through Hole; DatasheetVersion: Rev. G, 01/2012; Max Operating Temperature: 75 degC; ComponentLink2Description: Datasheet; Colour: Black; Pins: 3; Contact Plating: Gold; Package Quantity: 1; ComponentLink1URL: http://www.molex.com/
R43-R73 R76-R80 R82-R88 = CMP-009-00062-2: Jumper 0402 (1005 Metric); Pins: 2; Mounting Technology: SMT; Case/Package: 0402
R75 = DISCRETE_R: 0 0603
R81 = CMP-009-00017-5: Chip Resistor, 10 KOhm, +/- 1%, 01 W, -55 to 155 degC, 0603 (1608 Metric); Voltage Rating: 50V; Power: 100mW; RoHS Compliant: True; Min Operating Temperature: -55°C; Pins: 2; Case/Package: 0603; Mounting Technology: SM; Max Operating Temperature: 155°C; Tolerance: 1%